# Altium schematic sheet OverView.SchDoc
size A4
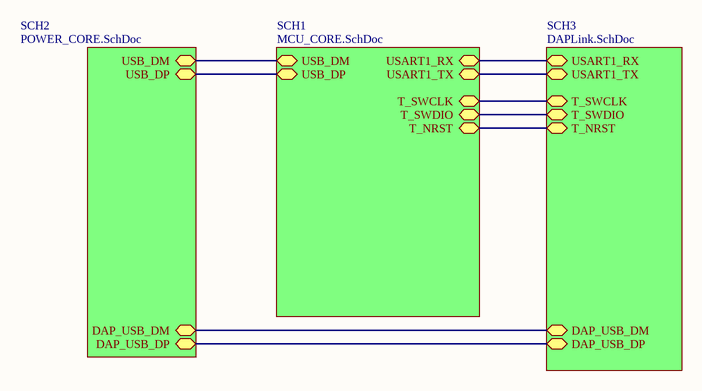
[diagram p0: OverView.SchDoc]

## Sub-sheets
SCH1 = MCU_CORE.SchDoc: USB_DM (bidir), USB_DP (bidir), USART1_RX (bidir), USART1_TX (bidir), T_SWCLK (bidir), T_SWDIO (bidir), T_NRST (bidir)
SCH2 = POWER_CORE.SchDoc: USB_DM (bidir), USB_DP (bidir), DAP_USB_DM (bidir), DAP_USB_DP (bidir)
SCH3 = DAPLink.SchDoc: USART1_RX (bidir), USART1_TX (bidir), DAP_USB_DM (bidir), DAP_USB_DP (bidir), T_SWCLK (bidir), T_SWDIO (bidir), T_NRST (bidir)

## Nets
(unnamed): sheet SCH1/USB_DM, sheet SCH2/USB_DM
(unnamed): sheet SCH1/USB_DP, sheet SCH2/USB_DP
(unnamed): sheet SCH1/USART1_RX, sheet SCH3/USART1_RX
(unnamed): sheet SCH1/USART1_TX, sheet SCH3/USART1_TX
(unnamed): sheet SCH1/T_SWCLK, sheet SCH3/T_SWCLK
(unnamed): sheet SCH1/T_SWDIO, sheet SCH3/T_SWDIO
(unnamed): sheet SCH1/T_NRST, sheet SCH3/T_NRST
(unnamed): sheet SCH2/DAP_USB_DM, sheet SCH3/DAP_USB_DM
(unnamed): sheet SCH2/DAP_USB_DP, sheet SCH3/DAP_USB_DP